# Altium schematic sheet LiveDesign JTAG Header.SchDoc
size A4
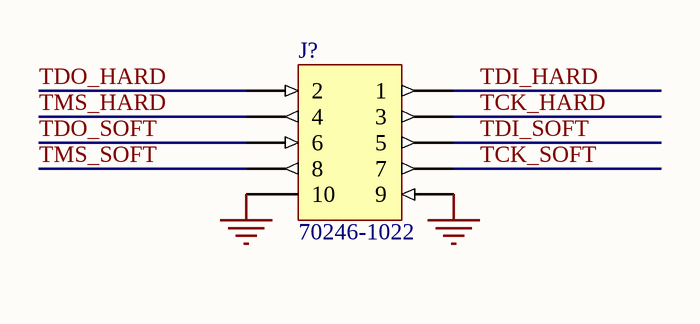
[diagram p0: LiveDesign JTAG Header.SchDoc]

## Parts
J?  70246-1022  [HDR2X5_LP]

## Nets
GND: J?.9 J?.10
TCK_HARD: J?.3
TCK_SOFT: J?.7
TDI_HARD: J?.1
TDI_SOFT: J?.5
TDO_HARD: J?.2
TDO_SOFT: J?.6
TMS_HARD: J?.4
TMS_SOFT: J?.8

## Library data of the parts
J? = Header 5X2: Header, 5-Pin, Dual row; Manufacturer: Molex; Class I: Connector; Fitted: True; Revision: July-2002: Re-released for DXP Platform.; Publisher: Altium Limited